# Altium project DM0249_R1M1E1.PrjPcb
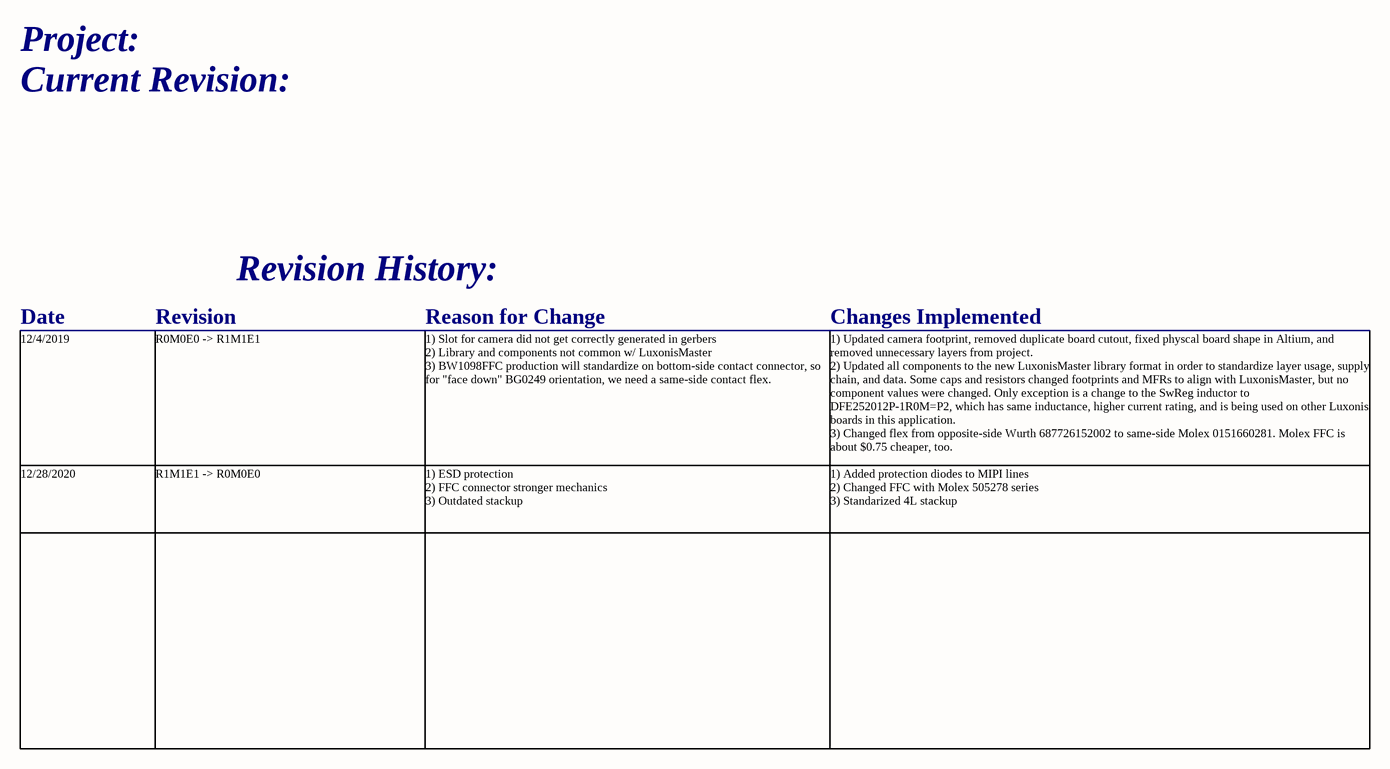
[diagram p0: Project_Information.SchDoc]
document_number: D000103; drawn_by: David Malovrh; project_title: DM0249; revision: R1M1E1
2 sheets, 27 parts. Net scope: global (net labels, ports and power ports of the same name join across sheets).
Board file: DM0249.PcbDoc
Sheets:
  Project_Information.SchDoc
  DM0249_IMX378.SchDoc

## Sheet Project_Information.SchDoc: =project_title
size Tabloid; CompanyName: Luxonis Holding; DrawnBy: David Malovrh; Organization: Luxonis Holding; Address1: 1925 Harmony Park Drive; Address2: Westminster, CO; Address3: 80234; Address4: United States; DocumentNumber: D000103; Revision: R1M1E1; SheetNumber: 1; SheetTotal: 3

### Notes on the sheet
- Project:
- Current Revision:
- Revision History:
- Date
- Revision
- Reason for Change
- Changes Implemented
- 12/4/2019
- R0M0E0 -> R1M1E1
- 1) Slot for camera did not get correctly generated in gerbers
  2) Library and components not common w/ LuxonisMaster
  3) BW1098FFC production will standardize on bottom-side contact connector, so for "face down" BG0249 orientation, we need a same-side contact flex.
- 1) Updated camera footprint, removed duplicate board cutout, fixed physcal board shape in Altium, and removed unnecessary layers from project.
  2) Updated all components to the new LuxonisMaster library format in order to standardize layer usage, supply chain, and data. Some caps and resistors changed footprints and MFRs to align with LuxonisMaster, but no component values were changed. Only exception is a change to the SwReg inductor to DFE252012P-1R0M=P2, which has same inductance, higher current rating, and is being used on other Luxonis boards in this application.
  3) Changed flex from opposite-side Wurth 687726152002 to same-side Molex 0151660281. Molex FFC is about $0.75 cheaper, too.
- 12/28/2020
- R1M1E1 -> R0M0E0
- 1) ESD protection
  2) FFC connector stronger mechanics
  3) Outdated stackup
- 1) Added protection diodes to MIPI lines
  2) Changed FFC with Molex 505278 series
  3) Standarized 4L stackup
- Title
- Size:
- Date:
- Tabloid
- Number:
- Time:
- Revision:
- Sheet
- of
- Drawn by:

## Sheet DM0249_IMX378.SchDoc: =project_title
size Tabloid; PageSetup: Record=PageOptions|CenterHorizontal=True|CenterVertical=True|PrintScale=0.71|XCorrection=1.00|YCorrection=1.00|PrintKind=0|BorderSize=5000000|LeftOffset=0|BottomOffset=0|Orientation=2|PaperLength=1000|PaperWidth=1000|Scale=100|PaperSource=7|PrintQuality=-4|MediaType=1|DitherType=10|PrintScaleMode=1|PaperKind=A4; CompanyName: Luxonis Holding; DrawnBy: David Malovrh; Organization: Luxonis Holding; Address1: 1925 Harmony Park Drive; Address2: Westminster, CO; Address3: 80234; Address4: United States; DocumentNumber: D000103; Revision: R1M1E1; SheetNumber: 3; SheetTotal: 3
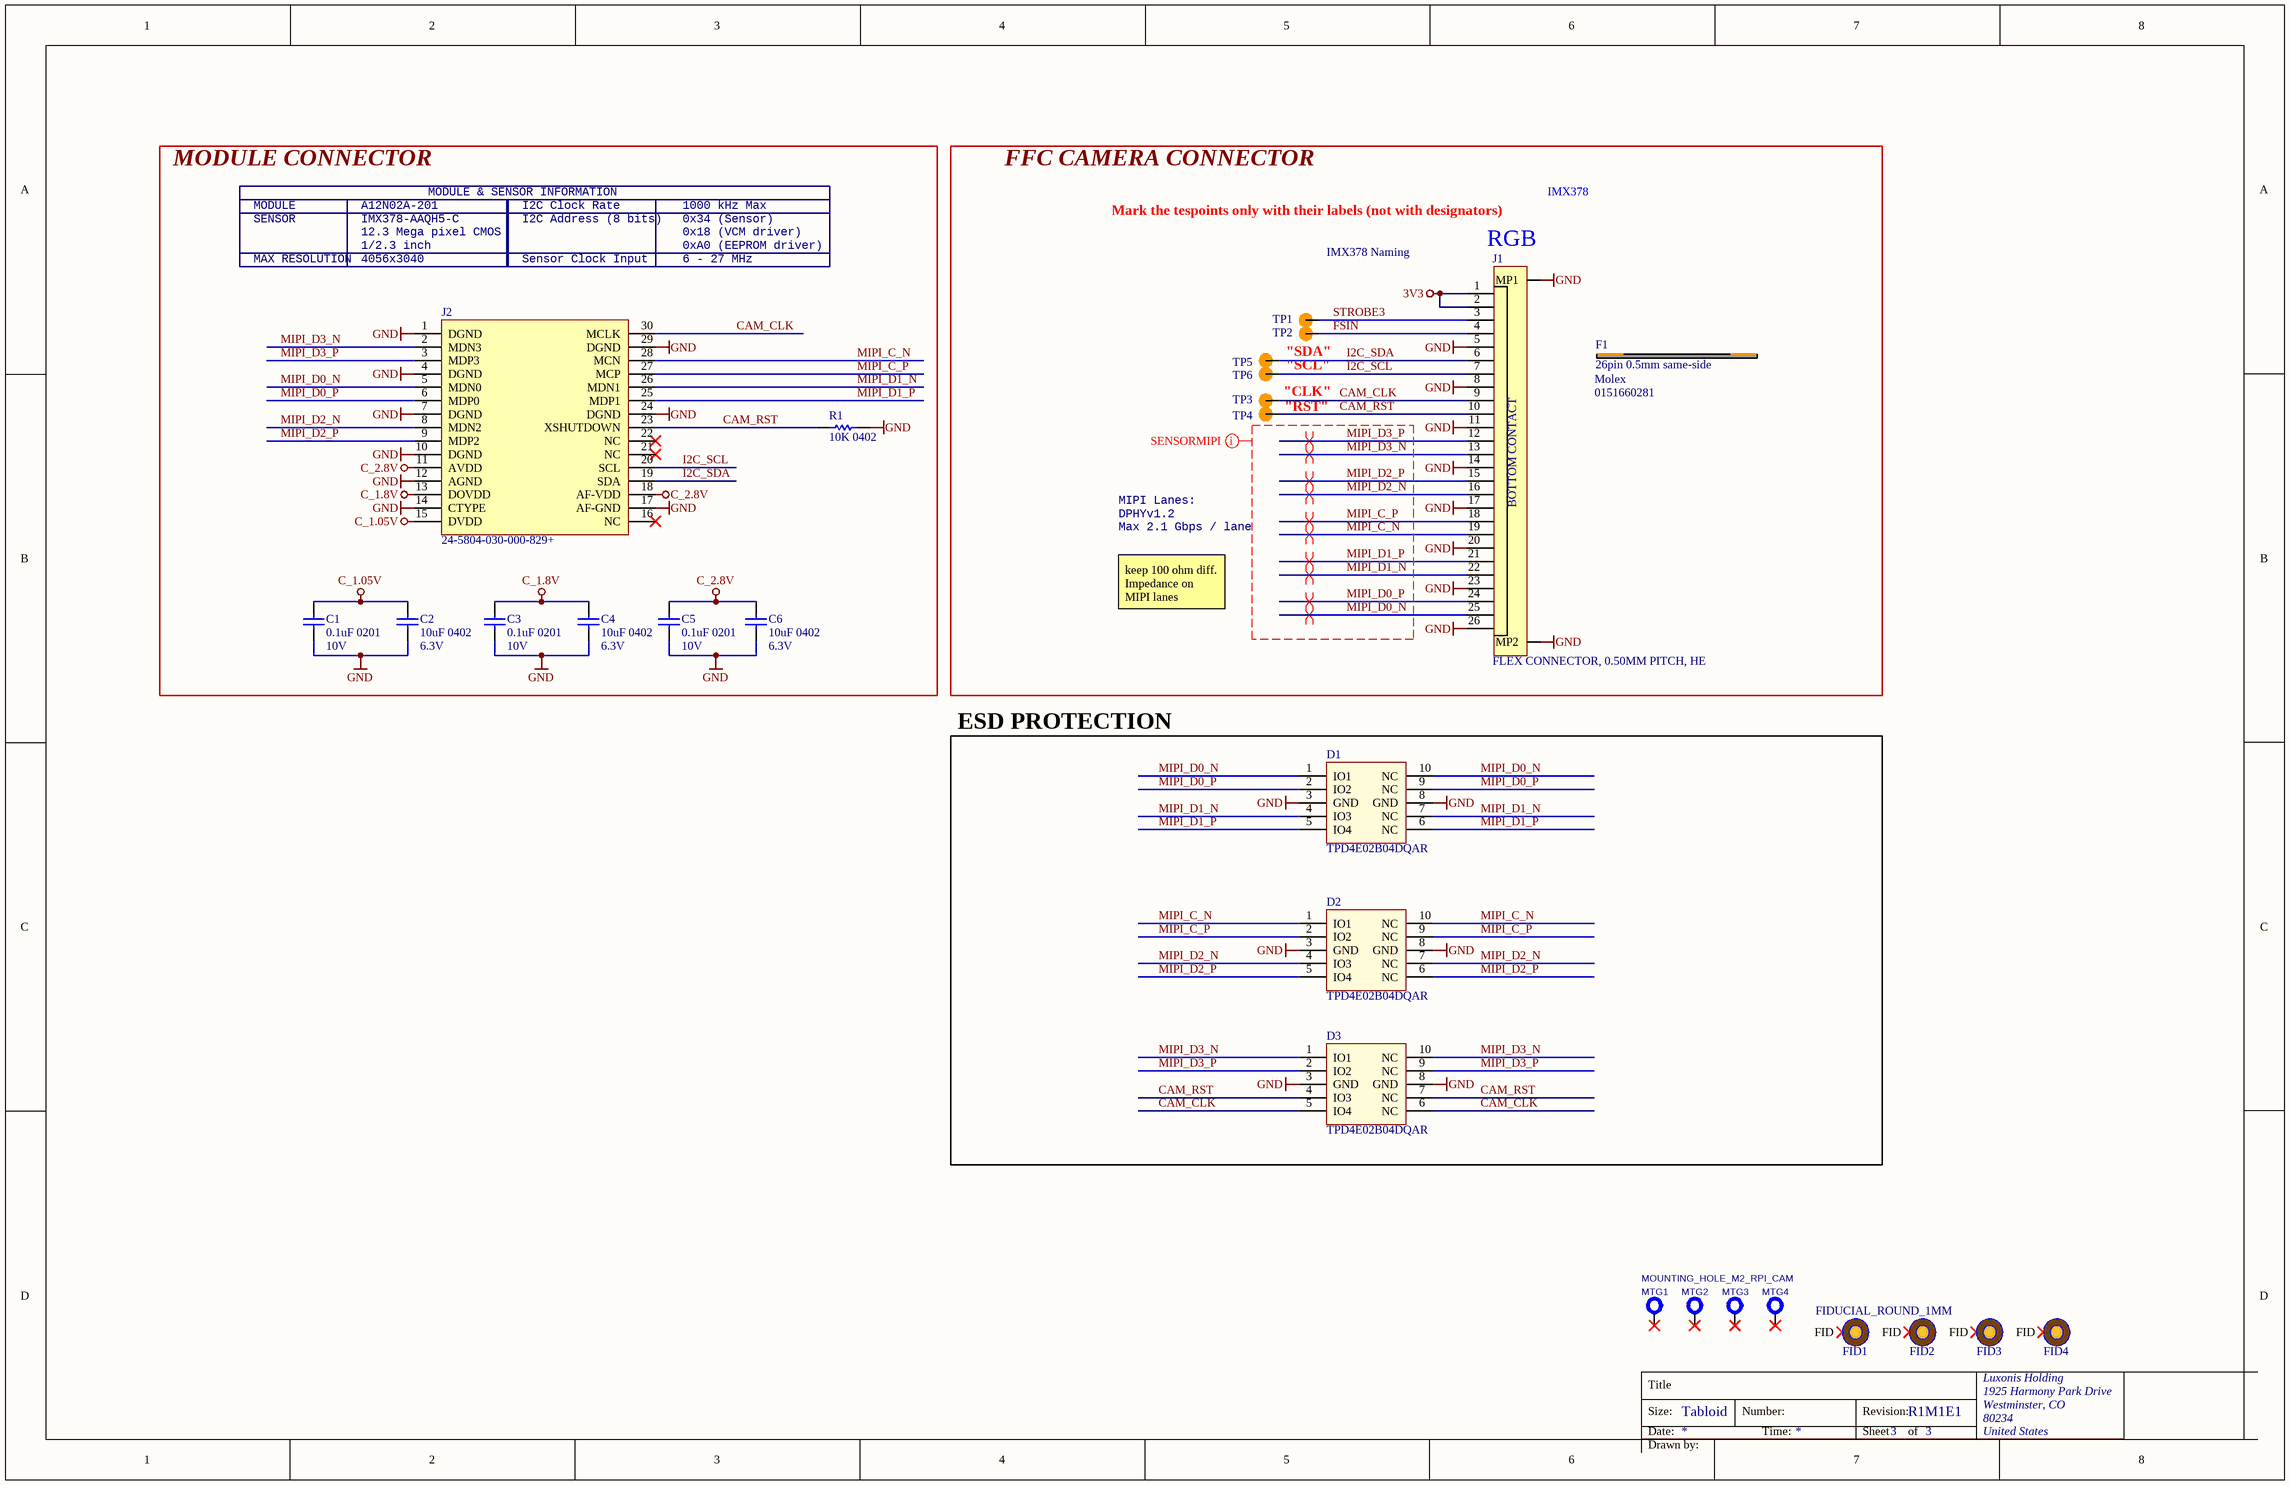
[diagram p1: DM0249_IMX378.SchDoc]

### Parts
C1  0.1uF 0201  Voltage: 10V  [CAPC0201(0603)33_N]
C2  10uF 0402  Voltage Rating: 6.3V  [CAPC0402(1005)70_N]
C3  0.1uF 0201  Voltage: 10V  [CAPC0201(0603)33_N]
C4  10uF 0402  Voltage Rating: 6.3V  [CAPC0402(1005)70_N]
C5  0.1uF 0201  Voltage: 10V  [CAPC0201(0603)33_N]
C6  10uF 0402  Voltage Rating: 6.3V  [CAPC0402(1005)70_N]
D1  TPD4E02B04DQAR  [TPD4E02B04DQAR]
D2  TPD4E02B04DQAR  [TPD4E02B04DQAR]
D3  TPD4E02B04DQAR  [TPD4E02B04DQAR]
F1  26pin 0.5mm same-side  Manufacturer 1: Molex  (mechanical)
FID1  FIDUCIAL_ROUND_1MM  [FIDUCIAL_ROUND_1MM]  (no BOM)
FID2  FIDUCIAL_ROUND_1MM  [FIDUCIAL_ROUND_1MM]  (value not drawn)  (no BOM)
FID3  FIDUCIAL_ROUND_1MM  [FIDUCIAL_ROUND_1MM]  (value not drawn)  (no BOM)
FID4  FIDUCIAL_ROUND_1MM  [FIDUCIAL_ROUND_1MM]  (value not drawn)  (no BOM)
J1  FLEX CONNECTOR, 0.50MM PITCH, HE  [F32R-1A7H1-11026]
J2  24-5804-030-000-829+  [A12N02A-201_1.6mmbrd_MatedModule]
MTG1  MOUNTING_HOLE_M2_RPI_CAM  [MOUNTING_HOLE_M2_RPI_CAM]  (no BOM)
MTG2  MOUNTING_HOLE_M2_RPI_CAM  [MOUNTING_HOLE_M2_RPI_CAM]  (value not drawn)  (no BOM)
MTG3  MOUNTING_HOLE_M2_RPI_CAM  [MOUNTING_HOLE_M2_RPI_CAM]  (value not drawn)  (no BOM)
MTG4  MOUNTING_HOLE_M2_RPI_CAM  [MOUNTING_HOLE_M2_RPI_CAM]  (value not drawn)  (no BOM)
R1  10K 0402  [RESC0402(1005)_N]
TP1  TP100_200_NS  [TP100_200_NS]  (value not drawn)  (no BOM)
TP2  TP100_200_NS  [TP100_200_NS]  (value not drawn)  (no BOM)
TP3  TP100_200_NS  [TP100_200_NS]  (value not drawn)  (no BOM)
TP4  TP100_200_NS  [TP100_200_NS]  (value not drawn)  (no BOM)
TP5  TP100_200_NS  [TP100_200_NS]  (value not drawn)  (no BOM)
TP6  TP100_200_NS  [TP100_200_NS]  (value not drawn)  (no BOM)

### Blocks framed on the sheet
MODULE CONNECTOR: C1-C6 J2 R1
ESD PROTECTION: D1-D3

### Nets
3V3: J1.1 J1.2
C_1.05V: C1.2 C2.2 J2.15(DVDD)
C_1.8V: C3.2 C4.2 J2.13(DOVDD)
C_2.8V: C5.2 C6.2 J2.11(AVDD) J2.18(AF-VDD)
GND: C1.1 C2.1 C3.1 C4.1 C5.1 C6.1 D1.3(GND) D1.8(GND) D2.3(GND) D2.8(GND) D3.3(GND) D3.8(GND) J1.5 J1.8 J1.11 J1.14 J1.17 J1.20 J1.23 J1.26 J1.MP1 J1.MP2 J2.1(DGND) J2.4(DGND) J2.7(DGND) J2.10(DGND) J2.12(AGND) J2.14(CTYPE) J2.17(AF-GND) J2.24(DGND) J2.29(DGND) R1.2
CAM_CLK: D3.5(IO4) D3.6(NC) J1.9 J2.30(MCLK) TP3.1
CAM_RST: D3.4(IO3) D3.7(NC) J1.10 J2.23(XSHUTDOWN) R1.1 TP4.1
FSIN: J1.4 TP2.1
I2C_SCL: J1.7 J2.20(SCL) TP6.1
I2C_SDA: J1.6 J2.19(SDA) TP5.1
MIPI_C_N: D2.1(IO1) D2.10(NC) J1.19 J2.28(MCN)
MIPI_C_P: D2.2(IO2) D2.9(NC) J1.18 J2.27(MCP)
MIPI_D0_N: D1.1(IO1) D1.10(NC) J1.25 J2.5(MDN0)
MIPI_D0_P: D1.2(IO2) D1.9(NC) J1.24 J2.6(MDP0)
MIPI_D1_N: D1.4(IO3) D1.7(NC) J1.22 J2.26(MDN1)
MIPI_D1_P: D1.5(IO4) D1.6(NC) J1.21 J2.25(MDP1)
MIPI_D2_N: D2.4(IO3) D2.7(NC) J1.16 J2.8(MDN2)
MIPI_D2_P: D2.5(IO4) D2.6(NC) J1.15 J2.9(MDP2)
MIPI_D3_N: D3.1(IO1) D3.10(NC) J1.13 J2.2(MDN3)
MIPI_D3_P: D3.2(IO2) D3.9(NC) J1.12 J2.3(MDP3)
STROBE3: J1.3 TP1.1

Not connected (* = marked no-connect by the designer): FID1 FID*; FID2 FID*; FID3 FID*; FID4 FID*; J2 16(NC)* 21(NC)* 22(NC)*; MTG1 1*; MTG2 1*; MTG3 1*; MTG4 1*

### Layout directives
net class SENSORMIPI: MIPI_C_N, MIPI_C_P, MIPI_D0_N, MIPI_D0_P, MIPI_D1_N, MIPI_D1_P, MIPI_D2_N, MIPI_D2_P, MIPI_D3_N, MIPI_D3_P
differential pair: MIPI_C_N, MIPI_C_P, MIPI_D0_N, MIPI_D0_P, MIPI_D1_N, MIPI_D1_P, MIPI_D2_N, MIPI_D2_P, MIPI_D3_N, MIPI_D3_P

### Notes on the sheet
- FFC CAMERA CONNECTOR
- SENSOR
- MODULE
- IMX378-AAQH5-C
- A12N02A-201
- MODULE & SENSOR INFORMATION
- I2C Address (8 bits)
- I2C Clock Rate
- 0x34 (Sensor)
- 1000 kHz Max
- Mark the tespoints only with their labels (not with designators)
- IMX378
- MAX RESOLUTION
- 12.3 Mega pixel CMOS
- 4056x3040
- 1/2.3 inch
- Sensor Clock Input
- 0x18 (VCM driver)
- 0xA0 (EEPROM driver)
- 6 - 27 MHz
- IMX378 Naming
- (near J1) RGB
- "SDA"
- "CLK"
- "RST"
- "SCL"
- MIPI Lanes:
- Max 2.1 Gbps / lane
- DPHYv1.2
- keep 100 ohm diff. Impedance on MIPI lanes
- Title
- Size:
- Date:
- Tabloid
- Number:
- Time:
- Revision:
- Sheet
- of
- Drawn by:
- (in symbol F32R-1A7H1-11026) BOTTOM CONTACT

### Library data of the parts
C1 C3 C5 = GRM033R61A104KE15D: CAP CER 0.1UF 10V X5R 0201; Manufacturer 1: Murata; Capacitance: 100nF; Tolerance: 10%; Supplier 1: Digi-Key; Manufacturer Part Number 1: GRM033R61A104KE15D; Stock 1: 45335312; Pricing 1: 1=0.10000, 10=0.04200, 100=0.01860, 500=0.01330, 1000=0.01045, 2500=0.00950, 5000=0.00874 (USD); RoHS: Yes; Mount: Surface Mount; Case/Package: 0201; Weight: 6E-06oz; Case Code (Metric): 0603; Case Code (Imperial): 0201; Min Operating Temperature: -55°C; Max Operating Temperature: 85°C; Packaging: Tape and Reel; Voltage Rating: 10V; Package Quantity: 1; Voltage Rating (DC): 10V; Dielectric: X5R; Termination: SMD/SMT; Length: 0.6mm; Height: 0.3mm; Width: 0.012inch; Thickness: 0.013inch; Depth: 0.3mm; Radiation Hardening: No; Lead Free: Lead Free; REACH SVHC: No SVHC; ComponentLink1URL: https://datasheet.ciiva.com/26843/getdatasheetpartid-308656-26843739.pdf?src-supplier=Verical; ComponentLink1Description: https://datasheet.ciiva.com/26843/getdatasheetpartid-308656-26843739.pdf?src-supplier=Verical; ComponentLink2URL: https://datasheet.ciiva.com/5413/product-5413117.pdf?src-supplier=Mouser; ComponentLink2Description: https://datasheet.ciiva.com/5413/product-5413117.pdf?src-supplier=Mouser; ComponentLink3URL: https://datasheet.ciiva.com/6256/partnumbering-e-01-6256406.pdf?src-supplier=Digi-Key; ComponentLink3Description: https://datasheet.ciiva.com/6256/partnumbering-e-01-6256406.pdf?src-supplier=Digi-Key; ComponentLink4URL: https://datasheet.ciiva.com/6256/partnumbering-e-01-6256407.pdf?src-supplier=Digi-Key; ComponentLink4Description: https://datasheet.ciiva.com/6256/partnumbering-e-01-6256407.pdf?src-supplier=Digi-Key; ComponentLink5URL: https://datasheet.ciiva.com/6256/partnumbering-e-01-6256408.pdf?src-supplier=Digi-Key; ComponentLink5Description: https://datasheet.ciiva.com/6256/partnumbering-e-01-6256408.pdf?src-supplier=Digi-Key; Supplier Part Number 1: 490-5881-1-ND
C2 C4 C6 = GRM155R60J106ME15D: CAP CER 10UF 6.3V X5R 0402 20%; Manufacturer 1: Murata; Supplier 1: Digi-Key; Manufacturer Part Number 1: GRM155R60J106ME15D; Stock 1: 1839627; Pricing 1: 1=0.23000, 10=0.15700, 100=0.07950, 500=0.05442, 1000=0.04814, 2500=0.04605, 5000=0.04186 (USD); RoHS: Yes; Mount: Surface Mount; Case/Package: 0402; Case Code (Metric): 1005; Case Code (Imperial): 0402; Min Operating Temperature: -55°C; Max Operating Temperature: 85°C; Packaging: Tape and Reel; Capacitance: 10uF; Dielectric: X5R; Length: 0.039inch; Width: 0.02inch; ComponentLink1URL: https://www.murata.com/~/media/webrenewal/support/library/catalog/products/capacitor/mlcc/c02e.ashx?la=en-us&src-supplier=Digi-Key; ComponentLink1Description: https://www.murata.com/~/media/webrenewal/support/library/catalog/products/capacitor/mlcc/c02e.ashx?la=en-us&src-supplier=Digi-Key; Supplier Part Number 1: 490-13238-1-ND; Voltage Rating (DC): 6.3V; Thickness: 0.026inch; Tolerance: 20%
D1-D3 = TPD4E02B04DQAR: TVS DIODE 3.6V 8.8V 10USON 8.8V (Typ) Clamp 5A (8/20µs) Ipp Tvs Diode Surface Mount 10-USON (2.5x1); Manufacturer 1: Texas Instruments; Number of Bidirectional Channels: 4; Min Breakdown Voltage: 5.5V; Peak Pulse Power: 17W; Power Line Protection: No; Interface: USB,HDMI; Supplier 1: Digi-Key; Manufacturer Part Number 1: TPD4E02B04DQAR; Stock 1: 25615; Pricing 1: 1=0.69000, 10=0.60800, 100=0.46650, 500=0.36874, 1000=0.29499 (USD); RoHS: Yes; Mount: Surface Mount; Number of Pins: 10; Min Operating Temperature: -40°C; Max Operating Temperature: 125°C; Packaging: Cut Tape; Reverse Standoff Voltage: 3.6V; Clamping Voltage: 8.8V; Operating Supply Voltage: 3.6V; Peak Pulse Current: 5A; Number of Channels: 4; Composition: Zener; REACH SVHC: No SVHC; Lead Free: Lead Free; ComponentLink1URL: http://www.ti.com/general/docs/lit/getliterature.tsp?genericPartNumber=TPD4E02B04&amp;&amp;fileType=pdf&src-supplier=Element14; ComponentLink1Description: http://www.ti.com/general/docs/lit/getliterature.tsp?genericPartNumber=TPD4E02B04&amp;&amp;fileType=pdf&src-supplier=Element14; ComponentLink2URL: http://www.ti.com/lit/ds/symlink/tpd4e02b04.pdf?src-supplier=Farnell; ComponentLink2Description: http://www.ti.com/lit/ds/symlink/tpd4e02b04.pdf?src-supplier=Farnell; ComponentLink3URL: http://www.ti.com/lit/ds/symlink/tpd4e02b04.pdf?src-supplier=Newark; ComponentLink3Description: http://www.ti.com/lit/ds/symlink/tpd4e02b04.pdf?src-supplier=Newark; ComponentLink4URL: http://www.ti.com/lit/ds/symlink/tpd4e02b04.pdf?src-supplier=Digi-Key; ComponentLink4Description: http://www.ti.com/lit/ds/symlink/tpd4e02b04.pdf?src-supplier=Digi-Key; Supplier Part Number 1: 296-43875-1-ND
F1 = 0151660281: CABLE FFC 26POS 0.50MM 6"; Number of Conductors: 26; Wire/Cable Type: Flat Flex; Pitch: 0.02inch; Supplier 1: Digi-Key; Manufacturer Part Number 1: 0151660281; Stock 1: 118; Pricing 1: 1=2.21000, 10=2.01000, 25=1.88680, 50=1.80460, 100=1.72260, 250=1.55856, 500=1.43552, 1000=1.23045, 2500=1.14842 (USD); RoHS: Yes; Number of Pins: 26; Packaging: Bulk; Package Quantity: 1000; Length: 6inch; Cable Pitch: 0.5mm; Radiation Hardening: No; ComponentLink1URL: https://datasheet.ciiva.com/10989/0151660281-cable-10989152.pdf?src-supplier=Avnet; ComponentLink1Description: https://datasheet.ciiva.com/10989/0151660281-cable-10989152.pdf?src-supplier=Avnet; ComponentLink2URL: https://datasheet.ciiva.com/2944/151660051-sd-2944673.pdf?src-supplier=Digi-Key; ComponentLink2Description: https://datasheet.ciiva.com/2944/151660051-sd-2944673.pdf?src-supplier=Digi-Key; Supplier 2: Mouser; Supplier Part Number 1: WM11334-ND; Supplier Part Number 2: 538-15166-0281
FID1-FID4 = FIDUCIAL: Fiducial with various available footprints
J1 = F32R-1A7H1-11026: 26 Position FFC, FPC Connector Contacts, Bottom 0.020" (0.50mm) Surface Mount, Right Angle; Manufacturer 1: Amphenol ICC (FCI); Number of Positions: 26; Voltage Rating: 50V; Current Rating: 500mA; Pitch: 0.02inch; Supplier 1: Digi-Key; Manufacturer Part Number 1: F32R-1A7H1-11026; RoHS: Yes; Category: Connectors; Pricing 1: 1=0.77, 10=0.721, 100=0.5529, 500=0.4808 (USD); Mount: Surface Mount; Contact Plating: Tin; Contact Material: Bronze; Min Operating Temperature: -40°C; Max Operating Temperature: 105°C; Packaging: Tape and Reel; Termination: Solder; Flammability Rating: UL94 V-0; ComponentLink1URL: https://cdn.amphenol-icc.com/media/wysiwyg/files/drawing/f32r-f32j.pdf; ComponentLink1Description: https://cdn.amphenol-icc.com/media/wysiwyg/files/drawing/f32r-f32j.pdf; Stock 1: 1709; Supplier Part Number 1: 609-F32R-1A7H1-11026CT-ND
J2 = A12N02A-201_Connector: CONN Series 5804 board to board 0.4mm pitch 30 way connector; Manufacturer 1: Kyocera International Electronic Components; Manufacturer Part Number 1: 245804030000829+; MAN: AVX/KYOCERA; MAN PN: 24-5804-030-000-829+; Supplier 1: Digi-Key; Stock 1: 11469; Pricing 1: 1=1.69000, 10=1.53600, 25=1.44200, 50=1.37940, 100=1.31670, 250=1.19132, 500=1.09726, 1000=0.94050 (USD); RoHS: Yes; ComponentLink1URL: http://global.kyocera.com/prdct/electro/product/pdf/5804.pdf?src-supplier=Digi-Key; ComponentLink1Description: http://global.kyocera.com/prdct/electro/product/pdf/5804.pdf?src-supplier=Digi-Key; Supplier Part Number 1: 478-12013-1-ND
MTG1-MTG4 = MP_Mounting-Holes: =CurrentFootprint; B - Value: Not a Part; A - Level: 0
R1 = RC0402FR-1310KL: RES SMD 10K OHM 1% 0402 1/16W Chip Resistor, 0402 [1005 Metric], 10 kohm, RC Series, 50 V, Thick Film, 62.5 mW; Manufacturer 1: Yageo; Resistance: 10kR; Temperature Coefficient: 100ppm/°C; Power Rating: 62.5mW; Voltage Rating: 50V; ComponentLink1URL: https://datasheet.ciiva.com/16940/pyu-rc0402-51-rohs-l-6-16940293.pdf?src-supplier=Avnet+Europe; ComponentLink1Description: https://datasheet.ciiva.com/16940/pyu-rc0402-51-rohs-l-6-16940293.pdf?src-supplier=Avnet+Europe; ComponentLink2URL: https://datasheet.ciiva.com/28386/pyu-rc0402-51-rohs-l-6-28386855.pdf?src-supplier=Avnet+Europe; ComponentLink2Description: https://datasheet.ciiva.com/28386/pyu-rc0402-51-rohs-l-6-28386855.pdf?src-supplier=Avnet+Europe; ComponentLink3URL: https://datasheet.ciiva.com/16740/pyu-rc0402-51-rohs-l-6-r-16740602.pdf?src-supplier=Future+Electronics; ComponentLink3Description: https://datasheet.ciiva.com/16740/pyu-rc0402-51-rohs-l-6-r-16740602.pdf?src-supplier=Future+Electronics; ComponentLink4URL: https://datasheet.ciiva.com/8891/pyu-rc0402-51-rohs-l-6-8891339.pdf?src-supplier=Avnet; ComponentLink4Description: https://datasheet.ciiva.com/8891/pyu-rc0402-51-rohs-l-6-8891339.pdf?src-supplier=Avnet; ComponentLink5URL: https://datasheet.ciiva.com/5557/pyu-rc0402-51-rohs-l-6-r-5557997.pdf?src-supplier=Mouser; ComponentLink5Description: https://datasheet.ciiva.com/5557/pyu-rc0402-51-rohs-l-6-r-5557997.pdf?src-supplier=Mouser; ComponentLink6URL: https://datasheet.ciiva.com/7983/1018594-7983533.pdf?src-supplier=Element14; ComponentLink6Description: https://datasheet.ciiva.com/7983/1018594-7983533.pdf?src-supplier=Element14; Supplier 1: Newark; Manufacturer Part Number 1: RC0402FR-1310KL; Stock 1: 62239; Pricing 1: 1=0.10000, 25=0.01200, 100=0.00400, 250=0.00400, 500=0.00300, 1000=0.00300 (USD); RoHS: Yes; Case/Package: 0402; Number of Pins: 2; Contact Plating: Tin,Matte,Lead; Case Code (Imperial): 0402; Case Code (Metric): 1005; Min Operating Temperature: -55°C; Max Operating Temperature: 155°C; Tolerance: 1%; Composition: Thick Film; Packaging: Tape and Reel; Termination: SMD/SMT; Military Standard: Not; Voltage Rating (DC): 50V; Working Voltage: 50V; Number of Terminations: 2; Length: 1mm; Depth: 0.5mm; Radiation Hardening: No; REACH SVHC: No SVHC; Lead Free: Lead Free; Supplier Part Number 1: 67R9960; Supplier 2: Future Electronics; Supplier 3: Mouser; Supplier 4: Element14; Supplier Part Number 2: RC0402FR-1310KL-CUTT; Supplier Part Number 3: 603-RC0402FR-1310KL; Supplier Part Number 4: 1799235
TP1-TP6 = TEST_POINT

## Assembly variants
Production: all parts fitted